# Altium schematic sheet General.SchDoc
size A4
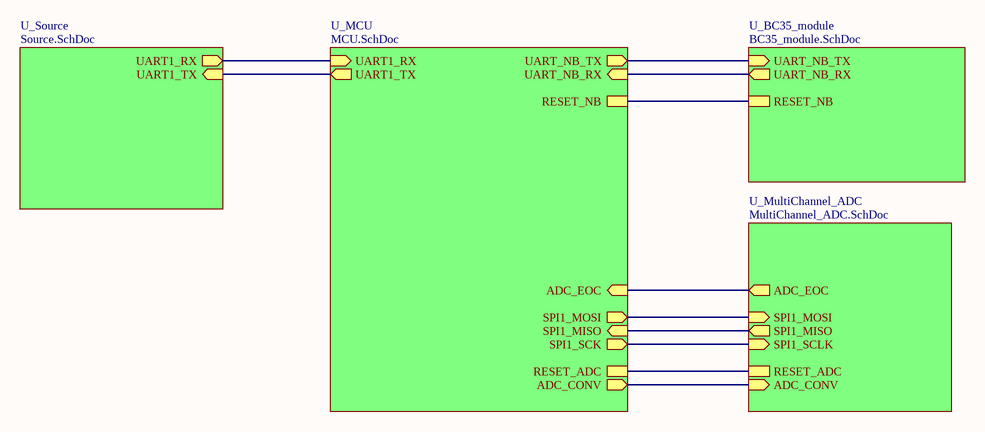
[diagram p0: General.SchDoc]

## Sub-sheets
U_BC35_module = BC35_module.SchDoc: UART_NB_TX (in), UART_NB_RX (out), RESET_NB
U_MCU = MCU.SchDoc: UART1_TX (out), UART1_RX (in), UART_NB_TX (out), UART_NB_RX (in), SPI1_SCK (out), SPI1_MOSI (out), SPI1_MISO (in), RESET_NB, RESET_ADC, ADC_EOC (in), ADC_CONV (out)
U_MultiChannel_ADC = MultiChannel_ADC.SchDoc: SPI1_MOSI (in), SPI1_MISO (out), SPI1_SCLK (in), ADC_CONV (in), ADC_EOC (out), RESET_ADC
U_Source = Source.SchDoc: UART1_TX (in), UART1_RX (out)

## Nets
(unnamed): sheet U_MCU/UART1_TX, sheet U_Source/UART1_TX
(unnamed): sheet U_MCU/UART1_RX, sheet U_Source/UART1_RX
(unnamed): sheet U_MCU/UART_NB_TX, sheet U_BC35_module/UART_NB_TX
(unnamed): sheet U_MCU/UART_NB_RX, sheet U_BC35_module/UART_NB_RX
(unnamed): sheet U_MCU/SPI1_SCK, sheet U_MultiChannel_ADC/SPI1_SCLK
(unnamed): sheet U_MCU/SPI1_MOSI, sheet U_MultiChannel_ADC/SPI1_MOSI
(unnamed): sheet U_MCU/SPI1_MISO, sheet U_MultiChannel_ADC/SPI1_MISO
(unnamed): sheet U_MCU/RESET_NB, sheet U_BC35_module/RESET_NB
(unnamed): sheet U_MCU/RESET_ADC, sheet U_MultiChannel_ADC/RESET_ADC
(unnamed): sheet U_MCU/ADC_EOC, sheet U_MultiChannel_ADC/ADC_EOC
(unnamed): sheet U_MCU/ADC_CONV, sheet U_MultiChannel_ADC/ADC_CONV